# Altium schematic sheet Smart Stepper Fin - Kinen Connector.SchDoc
size A
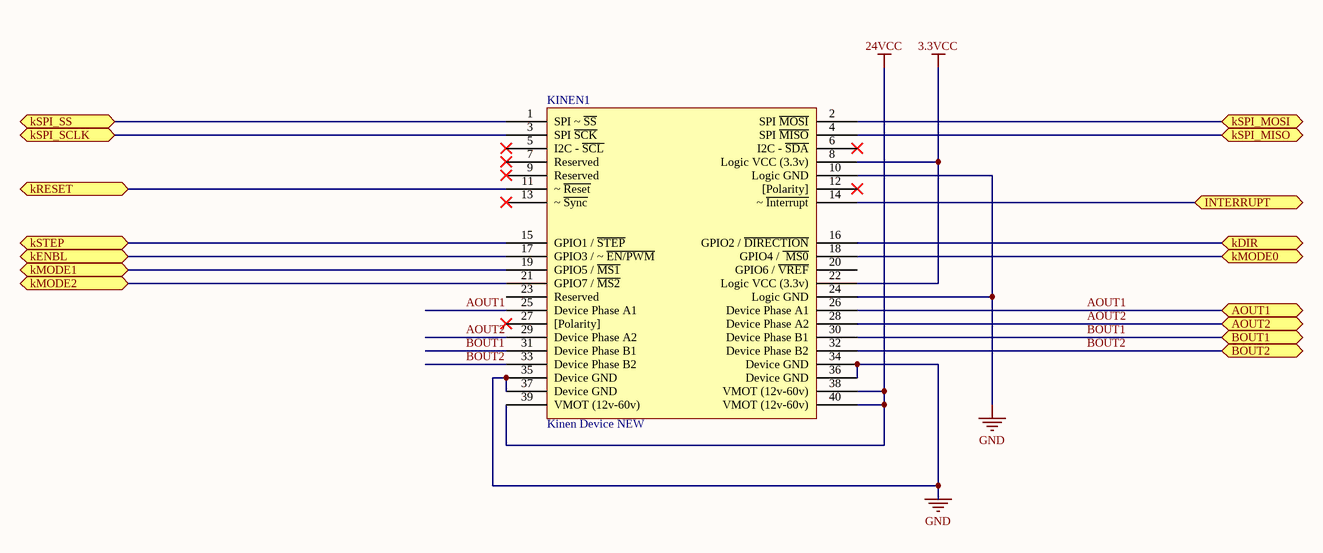
[diagram p0: Smart Stepper Fin - Kinen Connector.SchDoc]

## Parts
KINEN1  Kinen Device NEW  [Kinen Port - Device]

## Ports
AOUT1, AOUT2, BOUT1, BOUT2, INTERRUPT, kDIR, kENBL, kMODE0, kMODE1, kMODE2, kRESET, kSPI_MISO, kSPI_MOSI, kSPI_SCLK, kSPI_SS, kSTEP

## Nets
3.3VCC: KINEN1.8(Logic_VCC_(3.3v)) KINEN1.22(Logic_VCC_(3.3v))
24VCC: KINEN1.38(VMOT_(12v-60v)) KINEN1.39(VMOT_(12v-60v)) KINEN1.40(VMOT_(12v-60v))
GND: KINEN1.10(Logic_GND) KINEN1.24(Logic_GND) KINEN1.34(Device_GND) KINEN1.35(Device_GND) KINEN1.36(Device_GND) KINEN1.37(Device_GND)
AOUT1: KINEN1.25(Device_Phase_A1) KINEN1.26(Device_Phase_A1) ; port AOUT1
AOUT2: KINEN1.28(Device_Phase_A2) KINEN1.29(Device_Phase_A2) ; port AOUT2
BOUT1: KINEN1.30(Device_Phase_B1) KINEN1.31(Device_Phase_B1) ; port BOUT1
BOUT2: KINEN1.32(Device_Phase_B2) KINEN1.33(Device_Phase_B2) ; port BOUT2
INTERRUPT: KINEN1.14(~_~{Interrupt}) ; port INTERRUPT
kDIR: KINEN1.16(GPIO2_/_~{DIRECTION}) ; port kDIR
kENBL: KINEN1.17(GPIO3_/_~_~{EN/PWM}) ; port kENBL
kMODE0: KINEN1.18(GPIO4_/_~{_MS0}) ; port kMODE0
kMODE1: KINEN1.19(GPIO5_/_~{MS1}) ; port kMODE1
kMODE2: KINEN1.21(GPIO7_/_~{MS2}) ; port kMODE2
kRESET: KINEN1.11(~_~{Reset}) ; port kRESET
kSPI_MISO: KINEN1.4(SPI_~{MISO}) ; port kSPI_MISO
kSPI_MOSI: KINEN1.2(SPI_~{MOSI}) ; port kSPI_MOSI
kSPI_SCLK: KINEN1.3(SPI_~{SCK}) ; port kSPI_SCLK
kSPI_SS: KINEN1.1(SPI_~_~{SS}) ; port kSPI_SS
kSTEP: KINEN1.15(GPIO1_/_~{STEP}) ; port kSTEP

Not connected (* = marked no-connect by the designer): KINEN1 5(I2C_-_~{SCL})* 6(I2C_-_~{SDA})* 7(Reserved)* 9(Reserved)* 12([Polarity])* 13(~_~{Sync})* 20(GPIO6_/_~{VREF}) 23(Reserved) 27([Polarity])*